# EasyEDA Pro project 毕设.eprj, board PCB1
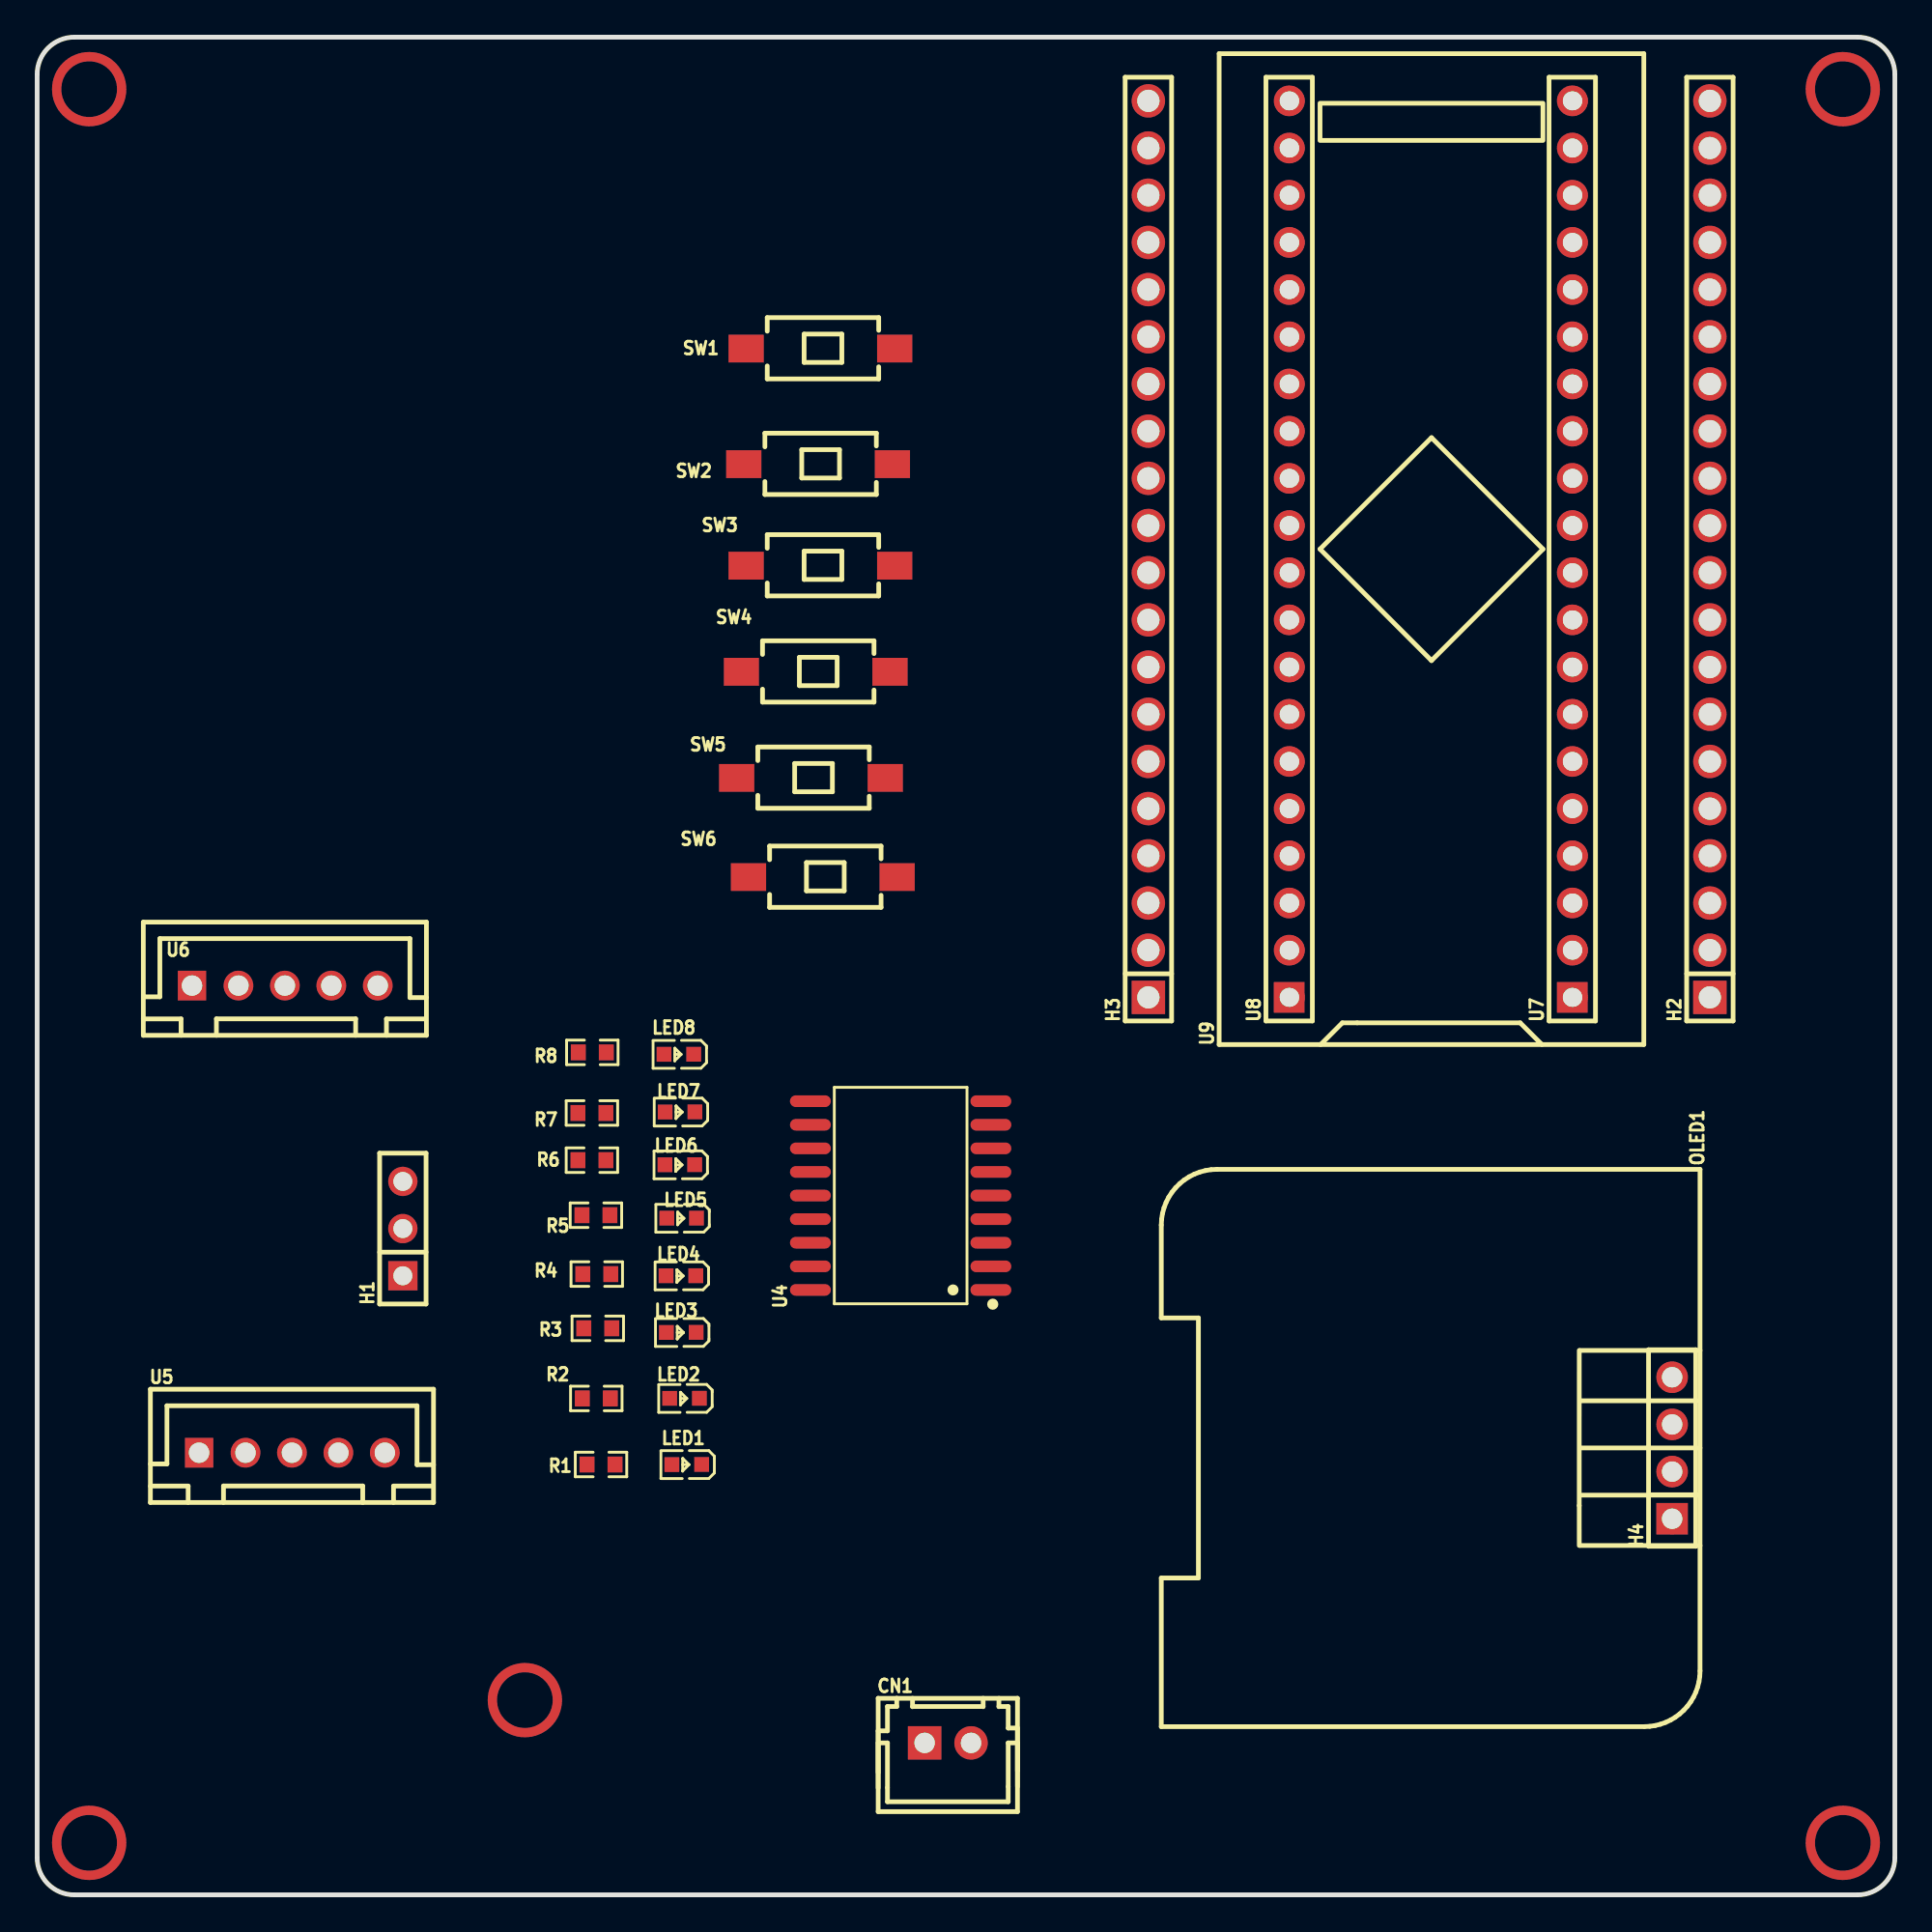
[diagram p2: board, top side]
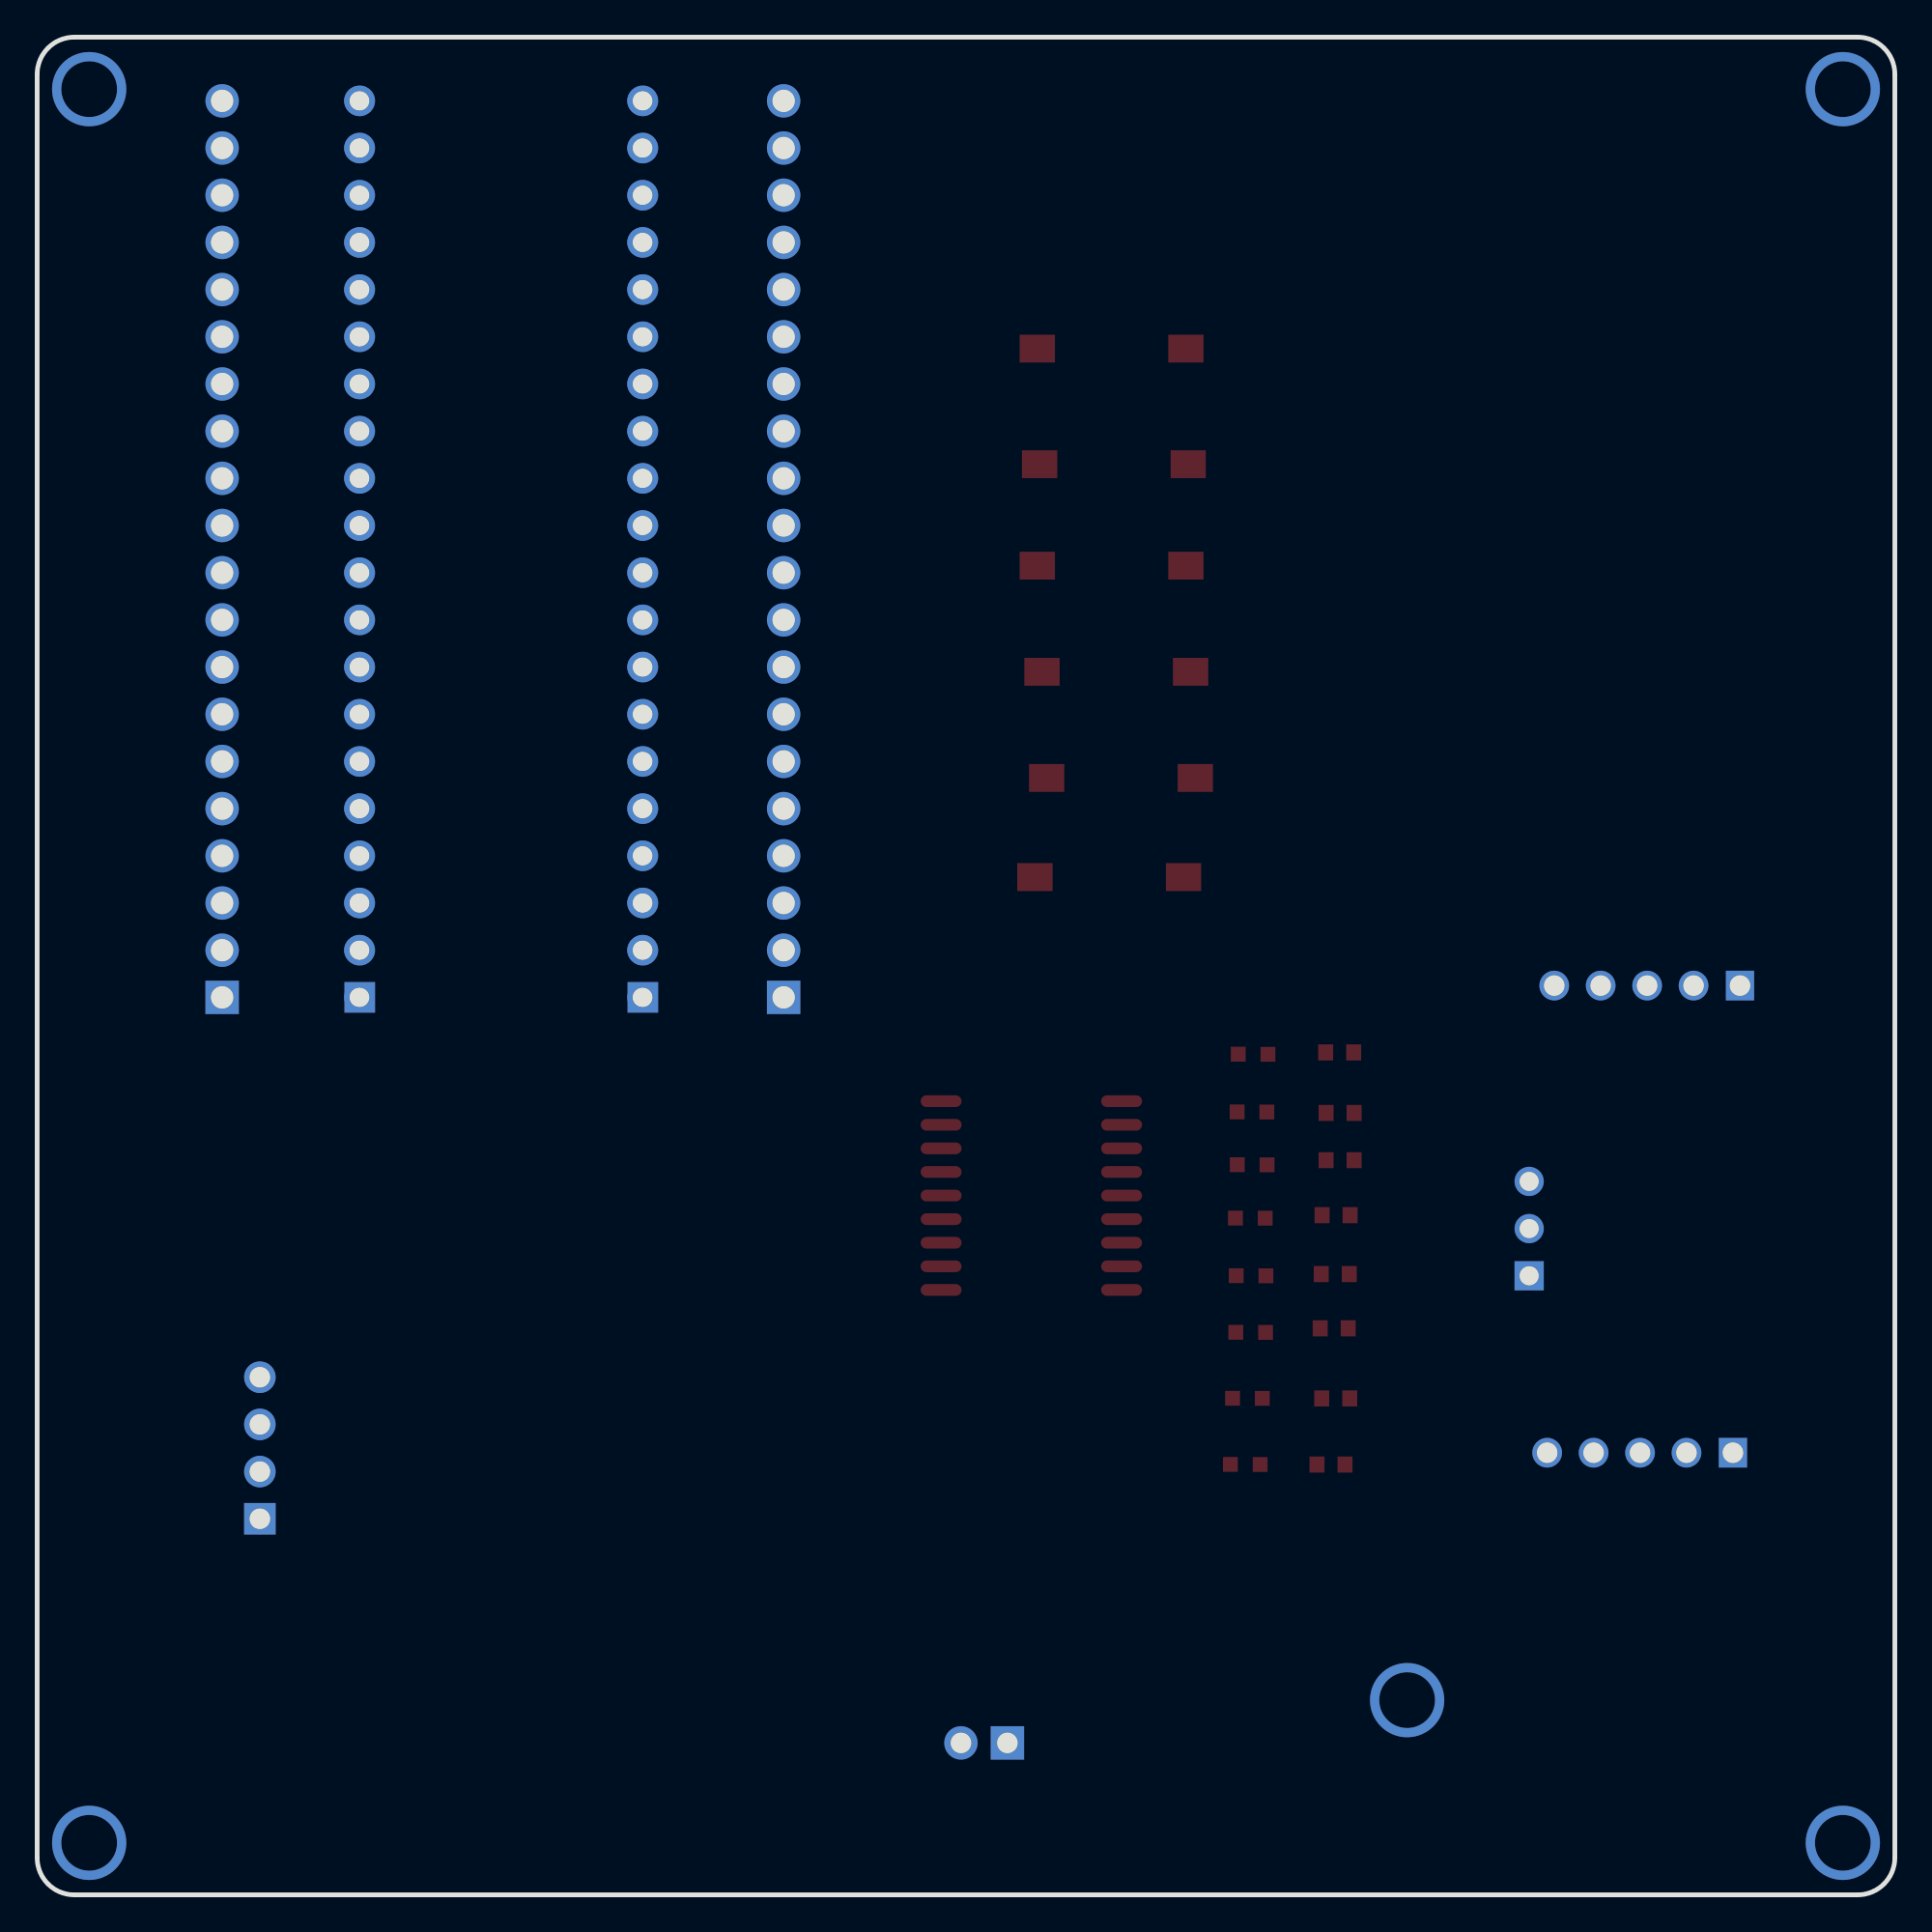
[diagram p3: board, bottom side, seen from below]

Outline 100 x 100 mm; copper layers: Top Layer, Bottom Layer. Coordinates in mm from the lower left corner of the outline.
Outline path: 0,98 0,2 arc(0.59,0.59) 2,0 98,0 arc(99.41,0.59) 100,2 100,98 arc(99.41,99.41) 98,100 2,100 arc(0.59,99.41) 0,98
Stack: Top Layer 0.035mm / Dielectric1 1.51mm FR4 er 4.5 / Bottom Layer 0.035mm

## Design rules (mm)
template: JLCPCB Capability(Two Layers Board)
spacing copperThickness1oz (default): track to track 0.102, other pairs 0.152 to 0.3
spacing copperThickness2oz: track to track 0.203, other pairs 0.152 to 0.3
track width copperThickness1oz (default): min 0.127, default 0.254, max 2.54
track width copperThickness2oz: min 0.203, default 0.254, max 2.54
differential pair differentialPair (default): width min 0.127, default 0.254, max 2.54; gap min 0.152, default 0.152
via viaSize (default): diameter min 0.5, default 0.61, max 10; hole min 0.3, default 0.305, max 6.3

## Placement (name value [footprint] x y rotation side)
CN1  ZX-XH2.54-2PZZ  [CONN-TH_2P-P2.50_HX25003-2A]  49.02 8.18 0 top
H1  -  [HDR-TH_3P-P2.54-V-F]  19.69 35.86 90 top
H2  -  [HDR-TH_20P-P2.54-V-M-1]  90.04 72.44 90 top
H3  -  [HDR-TH_20P-P2.54-V-M-1]  59.82 72.44 90 top
H4  -  [HDR-TH_4P-P2.54-V-F]  88.01 24.05 90 top
LED1  -  [LED_0603]  34.92 23.16 180 top
LED2  -  [LED_0603]  34.8 26.72 180 top
LED3  -  [LED_0603]  34.62 30.27 180 top
LED4  -  [LED_0603]  34.6 33.32 180 top
LED5  -  [LED_0603]  34.64 36.42 180 top
LED6  -  [LED_0603]  34.54 39.29 180 top
LED7  -  [LED_0603]  34.56 42.14 180 top
LED8  -  [LED_0603]  34.49 45.24 180 top
OLED1  0.96OLED_4P_MODULE_JX  [0.96OLED_4P]  88.01 24.05 270 top
R1  1K  [R0603]  30.35 23.16 180 top
R2  1K  [R0603]  30.1 26.72 180 top
R3  1K  [R0603]  30.18 30.5 180 top
R4  1K  [R0603]  30.12 33.42 180 top
R5  1K  [R0603]  30.08 36.59 180 top
R6  1K  [R0603]  29.86 39.55 180 top
R7  1K  [R0603]  29.86 42.09 180 top
R8  1K  [R0603]  29.88 45.35 180 top
SW1  TS-1101-C-W  [SW-SMD_L6.0-W3.3-LS8.0]  42.16 83.24 180 top
SW2  TS-1101-C-W  [SW-SMD_L6.0-W3.3-LS8.0]  42.04 77.01 180 top
SW3  TS-1101-C-W  [SW-SMD_L6.0-W3.3-LS8.0]  42.16 71.55 180 top
SW4  TS-1101-C-W  [SW-SMD_L6.0-W3.3-LS8.0]  41.91 65.84 180 top
SW5  TS-1101-C-W  [SW-SMD_L6.0-W3.3-LS8.0]  41.66 60.12 180 top
SW6  TS-1101-C-W  [SW-SMD_L6.0-W3.3-LS8.0]  42.29 54.79 180 top
U4  ULN2803  [SOP-18_L11.6-W7.5-P1.27-LS10.3-BL]  46.48 37.64 90 top
U5  ZX-XH2.54-5PZZ  [CONN-TH_5P-P2.50_ZX-XH2.54-5PZZ]  13.72 23.8 0 top
U6  ZX-XH2.54-5PZZ  [CONN-TH_5P-P2.50_ZX-XH2.54-5PZZ]  13.33 48.95 0 top
U7  PM254-1-20-Z-8.5  [HDR-TH_20P-P2.54-V-F-2]  82.64 72.44 90 top
U8  PM254-1-20-Z-8.5  [HDR-TH_20P-P2.54-V-F-2]  67.4 72.44 90 top
U9  LCKFB-DKX-STM32F103C8T6  [CONN-TH_L53.3-W22.9_STM32F103C8T6-CARD]  75.06 72.44 90 top

## Footprints (pads in the part's own frame, mm; a bottom-side part is the same pattern mirrored in y, then rotated)
0.96OLED_4P
  round 1.65 hole 1: 1(-3.81,-0.002) 2(-1.27,0.002) 3(1.27,0.002) 4(3.81,0.002)
CONN-TH_2P-P2.50_HX25003-2A
  rect 1.8x1.8 hole 1.1: 1(-1.25,0)
  round 1.8 hole 1.1: 2(1.25,0)
CONN-TH_5P-P2.50_ZX-XH2.54-5PZZ
  rect 1.524x1.6 hole 1.1: 1(-5,0)
  round 1.6 hole 1.1: 2(-2.5,0) 3(0,0) 4(2.5,0) 5(5,0)
CONN-TH_L53.3-W22.9_STM32F103C8T6-CARD
  round 1.6 hole 1: 1(-24.13,-7.62) 2(-21.59,-7.62) 3(-19.05,-7.62) 4(-16.51,-7.62) 5(-13.97,-7.62) 6(-11.43,-7.62) 7(-8.89,-7.62) 8(-6.35,-7.62) 9(-3.81,-7.62) 10(-1.27,-7.62) 11(1.27,-7.62) 12(3.81,-7.62) 13(6.35,-7.62) 14(8.89,-7.62) 15(11.43,-7.62) 16(13.97,-7.62) 17(16.51,-7.62) 18(19.05,-7.62) 19(21.59,-7.62) 20(24.13,-7.62) 21(24.13,7.62) 22(21.59,7.62) 23(19.05,7.62) 24(16.51,7.62) 25(13.97,7.62) 26(11.43,7.62) 27(8.89,7.62) 28(6.35,7.62) 29(3.81,7.62) 30(1.27,7.62) 31(-1.27,7.62) 32(-3.81,7.62) 33(-6.35,7.62) 34(-8.89,7.62) 35(-11.43,7.62) 36(-13.97,7.62) 37(-16.51,7.62) 38(-19.05,7.62) 39(-21.59,7.62) 40(-24.13,7.62)
HDR-TH_3P-P2.54-V-F
  rect 1.575x1.575 hole 1.02: 1(-2.54,0)
  round 1.575 hole 1.02: 2(0,0) 3(2.54,0)
HDR-TH_4P-P2.54-V-F
  rect 1.7x1.7 hole 1.1: 1(-3.81,0)
  round 1.7 hole 1.1: 2(-1.27,0) 3(1.27,0) 4(3.81,0)
HDR-TH_20P-P2.54-V-F-2
  rect 1.65x1.65 hole 1.02: 1(-24.13,0)
  round 1.65 hole 1.02: 2(-21.59,0) 3(-19.05,0) 4(-16.51,0) 5(-13.97,0) 6(-11.43,0) 7(-8.89,0) 8(-6.35,0) 9(-3.81,0) 10(-1.27,0) 11(1.27,0) 12(3.81,0) 13(6.35,0) 14(8.89,0) 15(11.43,0) 16(13.97,0) 17(16.51,0) 18(19.05,0) 19(21.59,0) 20(24.13,0)
HDR-TH_20P-P2.54-V-M-1
  rect 1.8x1.8 hole 1.2: 1(-24.13,0)
  round 1.8 hole 1.2: 2(-21.59,0) 3(-19.05,0) 4(-16.51,0) 5(-13.97,0) 6(-11.43,0) 7(-8.89,0) 8(-6.35,0) 9(-3.81,0) 10(-1.27,0) 11(1.27,0) 12(3.81,0) 13(6.35,0) 14(8.89,0) 15(11.43,0) 16(13.97,0) 17(16.51,0) 18(19.05,0) 19(21.59,0) 20(24.13,0)
LED_0603
  rect 0.8x0.8 smd: 1(-0.851,-0.01) 2(0.75,-0.005)
R0603
  rect 0.806x0.864 smd: 1(-0.753,0) 2(0.753,0)
SOP-18_L11.6-W7.5-P1.27-LS10.3-BL
  oval 0.63x2.2 smd: 1(-5.08,-4.857) 2(-3.81,-4.857) 3(-2.54,-4.857) 4(-1.27,-4.857) 5(0,-4.857) 6(1.27,-4.857) 7(2.54,-4.857) 8(3.81,-4.857) 9(5.08,-4.857) 10(5.08,4.857) 11(3.81,4.857) 12(2.54,4.857) 13(1.27,4.857) 14(0,4.857) 15(-1.27,4.857) 16(-2.54,4.857) 17(-3.81,4.857) 18(-5.08,4.857)
SW-SMD_L6.0-W3.3-LS8.0
  rect 1.9x1.5 smd: 1(-4,0) 2(4,0)

## Nets
As in the schematic.

Pads without a net: U9 1 2 3 4 5 6 7 8 9 10 11 12 13 14 15 16 17 18 19 20 21 22 23 24 25 26 27 28 29 30 31 32 33 34 35 36 37 38 39 40

## Via types
v1: diameter 4, hole 2.999, Top Layer to Bottom Layer, 5 vias

## Routing (per net, layer and track width the routed paths; a pad name or vN(x,y) marks a point on that pad's centre or on a via; arc(x,y) is an arc through that point)
(no net):
  vias: v1(2.8,97.2) v1(2.8,2.8) v1(26.25,10.48) v1(97.2,97.2) v1(97.2,2.8)
